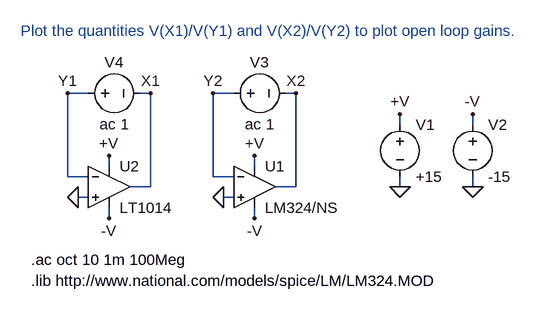
[diagram p0: schematic URL.asc]
URL.asc, the LTspice schematic file:
Version 4
SHEET 1 880 680
WIRE -112 240 -112 112
WIRE -80 112 -112 112
WIRE -80 240 -112 240
WIRE -80 272 -96 272
WIRE -48 224 -48 208
WIRE -48 304 -48 288
WIRE 16 112 0 112
WIRE 16 256 -16 256
WIRE 16 256 16 112
WIRE 112 240 112 112
WIRE 144 112 112 112
WIRE 144 240 112 240
WIRE 144 272 128 272
WIRE 176 224 176 208
WIRE 176 304 176 288
WIRE 240 112 224 112
WIRE 240 256 208 256
WIRE 240 256 240 112
WIRE 400 160 400 144
WIRE 400 256 400 240
WIRE 512 160 512 144
WIRE 512 256 512 240
FLAG 176 208 +V
FLAG 176 304 -V
FLAG 512 256 0
FLAG 400 256 0
FLAG 400 144 +V
FLAG 512 144 -V
FLAG 128 272 0
FLAG 240 112 X2
FLAG 112 112 Y2
FLAG -48 208 +V
FLAG -48 304 -V
FLAG -96 272 0
FLAG 16 112 X1
FLAG -112 112 Y1
SYMBOL opamps\\opamp2 176 192 R0
SYMATTR InstName U1
SYMATTR Value LM324/NS
SYMBOL voltage 400 144 R0
SYMATTR InstName V1
SYMATTR Value +15
SYMBOL voltage 512 144 R0
SYMATTR InstName V2
SYMATTR Value -15
SYMBOL voltage 128 112 R270
WINDOW 0 32 56 VTop 0
WINDOW 3 -32 56 VBottom 0
SYMATTR InstName V3
SYMATTR Value ac 1
SYMBOL voltage -96 112 R270
WINDOW 0 32 56 VTop 0
WINDOW 3 -32 56 VBottom 0
SYMATTR InstName V4
SYMATTR Value ac 1
SYMBOL opamps\\LT1014 -48 192 R0
SYMATTR InstName U2
TEXT -168 400 Left 0 !.lib http://www.national.com/models/spice/LM/LM324.MOD
TEXT -168 368 Left 0 !.ac oct 10 1m 100Meg
TEXT -184 16 Left 0 ;Plot the quantities V(X1)/V(Y1) and V(X2)/V(Y2) to plot open loop gains.

The netlist it stands for:
* URL.asc
XU1 0 Y2 +V -V X2 LM324/NS  ; pins In+ In- V+ V- OUT
V1 +V 0 +15
V2 -V 0 -15
V3 Y2 X2 ac 1
V4 Y1 X1 ac 1
XU2 0 Y1 +V -V X1 LT1014  ; pins In+ In- V+ V- OUT
.lib http://www.national.com/models/spice/LM/LM324.MOD
.ac oct 10 1m 100Meg
* Plot the quantities V(X1)/V(Y1) and V(X2)/V(Y2) to plot open loop gains.
.backanno
.end